# EAGLE schematic rev_i_v127 (EAGLE 9.7.0)
AUTHOR: Pat Pannuto; REV: I; TITLE: TotTag

## Sheet 1 of 5: nRF8240
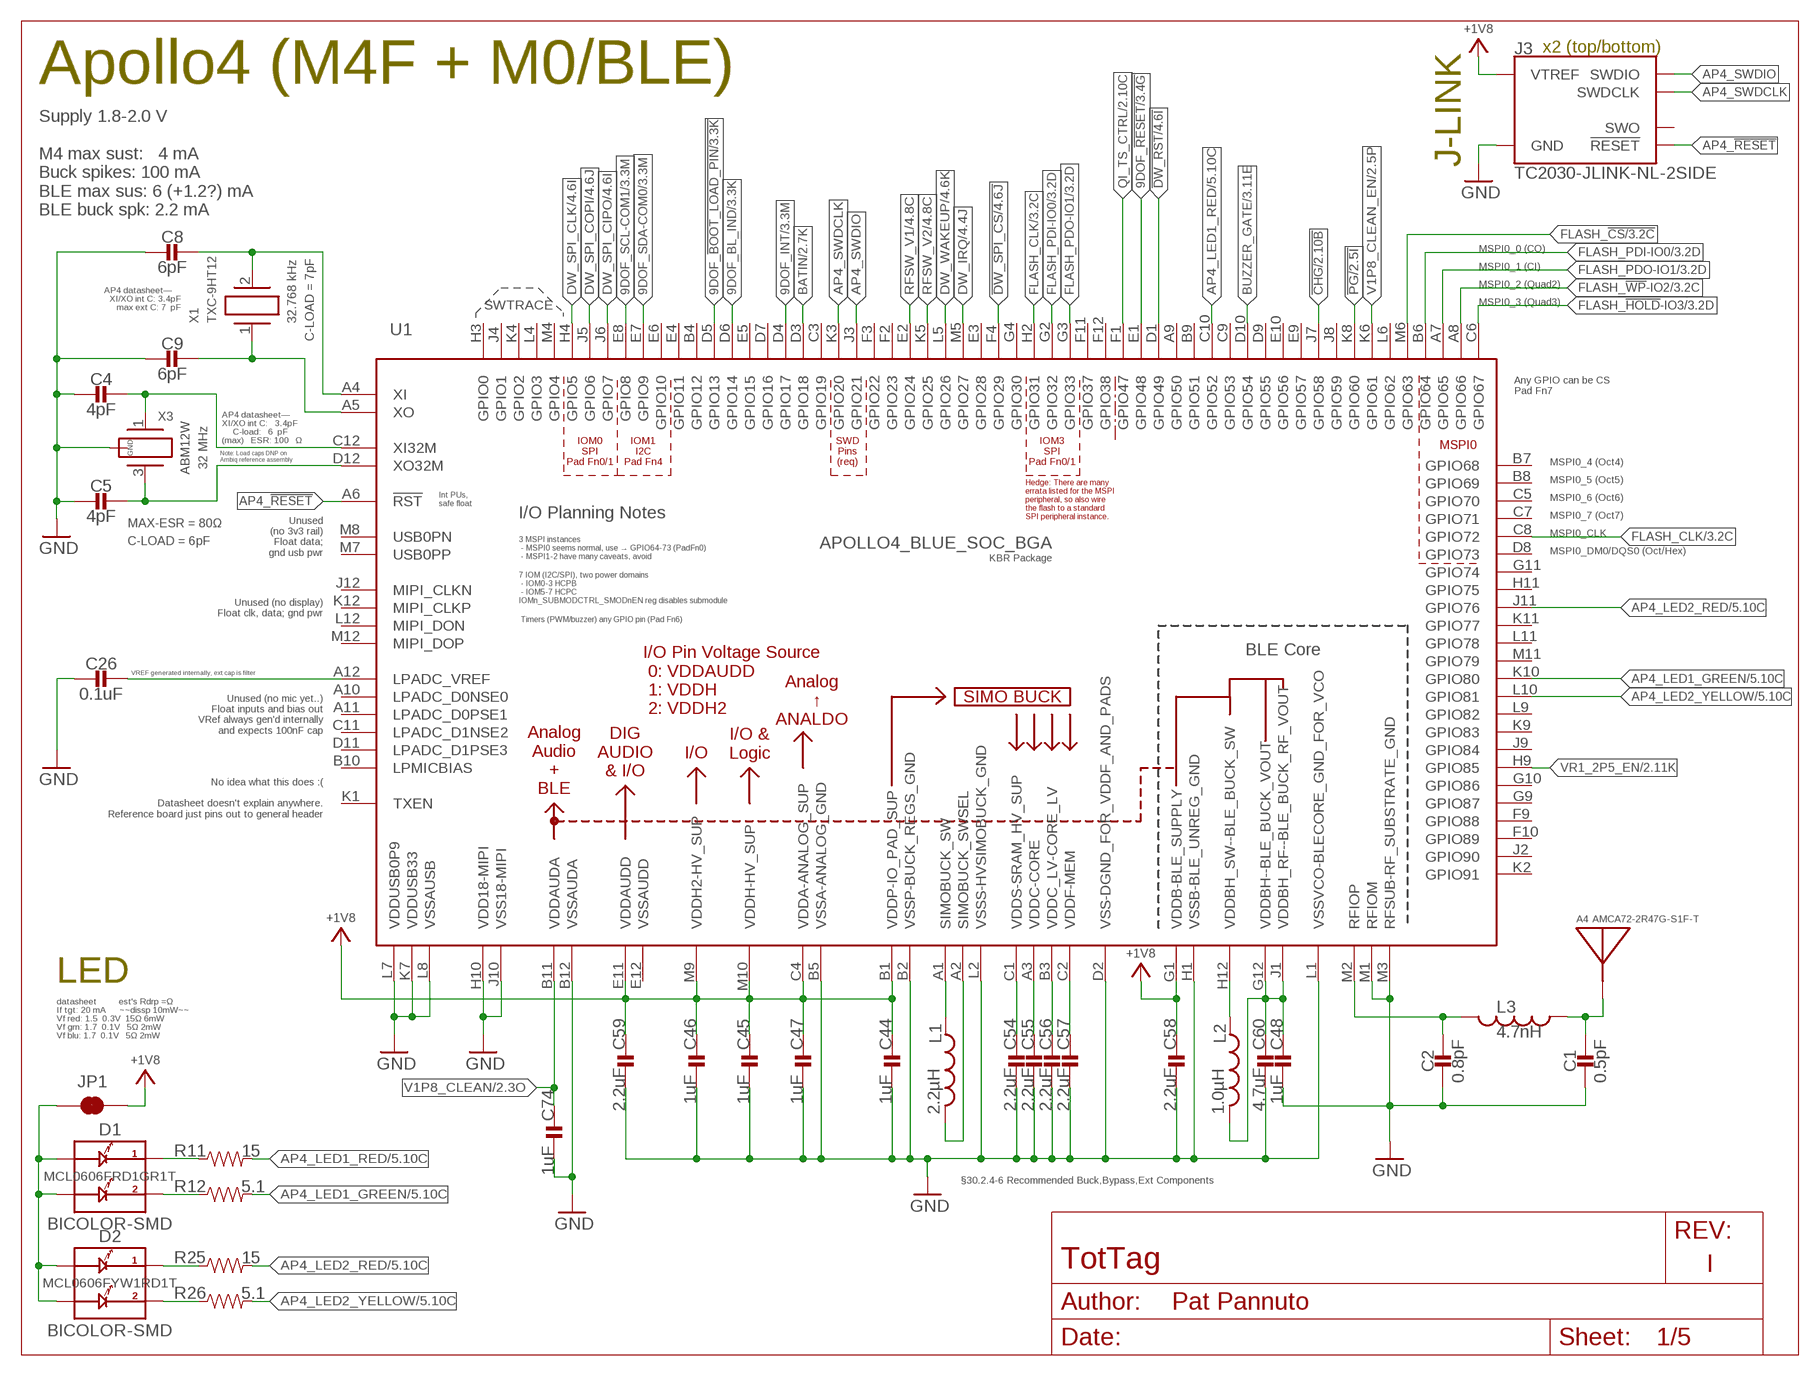
[diagram p0: schematic, sheet 1]

### Parts
A4  AMCA72-2R47G-S1F-T  [AMCA72-2R470G-S1F-T]
C1  0.5pF  CAPACITOR0402_CAP  [0402_CAP]
C2  0.8pF  CAPACITOR0402_CAP  [0402_CAP]
C4  4pF  CAPACITOR0201_CAP  [0201_CAP]
C5  4pF  CAPACITOR0201_CAP  [0201_CAP]
C8  6pF  CAPACITOR0201_CAP  [0201_CAP]
C9  6pF  CAPACITOR0201_CAP  [0201_CAP]
C26  0.1uF  CAPACITOR0201_CAP  [0201_CAP]
C44  1uF  CAPACITOR0201_CAP  [0201_CAP]
C45  1uF  CAPACITOR0201_CAP  [0201_CAP]
C46  1uF  CAPACITOR0201_CAP  [0201_CAP]
C47  1uF  CAPACITOR0201_CAP  [0201_CAP]
C48  1uF  CAPACITOR0201_CAP  [0201_CAP]
C54  2.2uF  CAPACITOR0201_CAP  [0201_CAP]
C55  2.2uF  CAPACITOR0201_CAP  [0201_CAP]
C56  2.2uF  CAPACITOR0201_CAP  [0201_CAP]
C57  2.2uF  CAPACITOR0201_CAP  [0201_CAP]
C58  2.2uF  CAPACITOR0201_CAP  [0201_CAP]
C59  2.2uF  CAPACITOR0201_CAP  [0201_CAP]
C60  4.7uF  CAPACITOR0402_CAP  [0402_CAP]
C74  1uF  CAPACITOR0201_CAP  [0201_CAP]
D1  BICOLOR-SMD  [LED-0606]
D2  BICOLOR-SMD  [LED-0606]
J3  TC2030-JLINK-NL-2SIDE  [TC2030-IDC-NL-2SIDE]
JP1  JUMPER-SMT_2_NC_TRACE_SILK  [SMT-JUMPER_2_NC_TRACE_SILK]
L1  2.2µH  INDUCTOR0805  [0805_CAP]
L2  1.0µH  INDUCTOR0603  [0603_CAP]
L3  4.7nH  INDUCTOR0402  [0402_CAP]
R11  15  RESISTOR0402_RES  [0402_RES]
R12  5.1  RESISTOR0402_RES  [0402_RES]
R25  15  RESISTOR0402_RES  [0402_RES]
R26  5.1  RESISTOR0402_RES  [0402_RES]
U1  APOLLO4_BLUE_SOC_BGA  [APOLLO4_BLUE_SOC_BGA]
X1  TXC-9HT12  [TXC-9HT12]
X3  ABM12W  [ABM12W]

### Nets
9DOF_!BOOT_LOAD_PIN: U1.D5(GPIO13) ; also sheet 3
9DOF_!RESET: U1.E1(GPIO48) ; also sheet 3
9DOF_BL_IND: U1.D6(GPIO14) ; also sheet 3
9DOF_INT: U1.D4(GPIO17) ; also sheet 3,5
9DOF_SCL-COM1: U1.E8(GPIO8) ; also sheet 3,5
9DOF_SDA-COM0: U1.E7(GPIO9) ; also sheet 3,5
!CHG: U1.J7(GPIO58) ; also sheet 2
!DW_RST: U1.D1(GPIO49) ; also sheet 4
!DW_SPI_CS: U1.F4(GPIO29) ; also sheet 4,5
!PG: U1.K8(GPIO60) ; also sheet 2
+1V8: C44.P$1 C45.P$1 C46.P$1 C47.P$1 C58.P$1 C59.P$1 J3.1(VTREF) J3.B1(VTREF) JP1.2 U1.B1(VDDP-IO_PAD_SUP) U1.C4(VDDA-ANALOG_SUP) U1.E11(VDDAUDD) U1.G1(VDDB-BLE_SUPPLY) U1.M9(VDDH2-HV_SUP) U1.M10(VDDH-HV_SUP) ; also sheet 2,3,4
AP4_!RESET: J3.3(!RESET) J3.B3(!RESET) U1.A6(!RST)
AP4_LED1_GREEN: R12.2 U1.K10(GPIO80) ; also sheet 5
AP4_LED1_RED: R11.2 U1.C10(GPIO52) ; also sheet 5
AP4_LED2_BLUE_COMM: D1.1-C1(C1) R11.1
AP4_LED2_RED: R25.2 U1.J11(GPIO76) ; also sheet 5
AP4_LED2_YELLOW: R26.2 U1.L10(GPIO81) ; also sheet 5
AP4_LED_BLUE_COMM: D2.2-C2(C2) R26.1
AP4_LED_GREEN_COMM: D2.1-C1(C1) R25.1
AP4_LED_RED_COMM: D1.2-C2(C2) R12.1
AP4_LPADC_VREF: C26.P$1 U1.A12(LPADC_VREF)
AP4_RFIOP: C2.1 L3.2 U1.M2(RFIOP)
AP4_SWDCLK: J3.4(SWDCLK) J3.B4(SWDCLK) U1.K3(GPIO20)
AP4_SWDIO: J3.2(SWDIO) J3.B2(SWDIO) U1.J3(GPIO21)
AP4_VDDBH: C48.P$1 C60.1 L2.2 U1.G12(VDDBH--BLE_BUCK_VOUT) U1.J1(VDDBH_RF--BLE_BUCK_RF_VOUT)
AP4_VDDBH_SW: L2.1 U1.H12(VDDBH_SW--BLE_BUCK_SW)
AP4_VDDC: C55.P$1 U1.A3(VDDC-CORE)
AP4_VDDC_LV: C56.P$1 U1.B3(VDDC_LV-CORE_LV)
AP4_VDDF: C57.P$1 U1.C2(VDDF-MEM)
AP4_VDDS: C54.P$1 U1.C1(VDDS-SRAM_HV_SUP)
AP4_XI: C8.P$1 U1.A4(XI) X1.2
AP4_XI32M: C4.P$1 U1.C12(XI32M) X3.1
AP4_XO: C9.P$1 U1.A5(XO) X1.1
AP4_XO32M: C5.P$1 U1.D12(XO32M) X3.3
BATIN: U1.D3(GPIO18) ; also sheet 2
BLE_ANT_FEED: A4.S1(ANTENNA) C1.1 L3.1
BUZZER_GATE: U1.D10(GPIO54) ; also sheet 3
DW_IRQ: U1.M5(GPIO27) ; also sheet 4
DW_SPI_CIPO: U1.J6(GPIO7) ; also sheet 4,5
DW_SPI_CLK: U1.H4(GPIO5) ; also sheet 4,5
DW_SPI_COPI: U1.J5(GPIO6) ; also sheet 4,5
DW_WAKEUP: U1.L5(GPIO26) ; also sheet 4
FLASH_!CS: U1.M6(GPIO63) ; also sheet 3,5
FLASH_!HOLD!-IO3: U1.C6(GPIO67) ; also sheet 3,5
FLASH_!WP!-IO2: U1.A8(GPIO66) ; also sheet 3,5
FLASH_CLK: U1.C8(GPIO72) U1.H2(GPIO31) ; also sheet 3,5
FLASH_PDI-IO0: U1.B6(GPIO64) U1.G2(GPIO32) ; also sheet 3,5
FLASH_PDO-IO1: U1.A7(GPIO65) U1.G3(GPIO33) ; also sheet 3,5
GND: C1.2 C2.2 C4.P$2 C5.P$2 C8.P$2 C9.P$2 C26.P$2 C44.P$2 C45.P$2 C46.P$2 C47.P$2 C48.P$2 C54.P$2 C55.P$2 C56.P$2 C57.P$2 C58.P$2 C59.P$2 C60.2 C74.P$2 J3.5(GND) J3.B5(GND) U1.B2(VSSP-BUCK_REGS_GND) U1.B5(VSSA-ANALOG_GND) U1.B12(VSSAUDA) U1.D2(VSS-DGND_FOR_VDDF_AND_PADS) U1.H1(VSSB-BLE_UNREG_GND) U1.H10(VDD18-MIPI) U1.J10(VSS18-MIPI) U1.K7(VDDUSB33) U1.L1(VSSVCO-BLECORE_GND_FOR_VCO) U1.L2(VSSS-HVSIMOBUCK_GND) U1.L7(VDDUSB0P9) U1.L8(VSSAUSB) U1.M1(RFIOM) U1.M3(RFSUB-RF_SUBSTRATE_GND) X3.2(GND) X3.4(GND) ; also sheet 2,3,4
LED_SUP: D1.3-A1(A1) D1.4-A2(A2) D2.3-A1(A1) D2.4-A2(A2) JP1.1
N$8: L1.P$1 U1.A1(SIMOBUCK_SW)
N$14: L1.P$2 U1.A2(SIMOBUCK_SWSEL)
QI_TS_CTRL: U1.F1(GPIO47) ; also sheet 2
RFSW_V1: U1.E2(GPIO24) ; also sheet 4
RFSW_V2: U1.K5(GPIO25) ; also sheet 4
V1P8_CLEAN: C74.P$1 U1.B11(VDDAUDA) ; also sheet 2
V1P8_CLEAN_EN: U1.K6(GPIO61) ; also sheet 2
VR1_2P5_EN: U1.H9(GPIO85) ; also sheet 2
Unconnected: J3.6(SWO) J3.B6(SWO) U1.A9(GPIO50) U1.A10(LPADC_D0NSE0) U1.A11(LPADC_D0PSE1) U1.B4(GPIO12) U1.B7(GPIO68) U1.B8(GPIO69) U1.B9(GPIO51) U1.B10(LPMICBIAS) U1.C3(GPIO19) U1.C5(GPIO70) U1.C7(GPIO71) U1.C9(GPIO53) U1.C11(LPADC_D1NSE2) U1.D7(GPIO16) U1.D8(GPIO73) U1.D9(GPIO55) U1.D11(LPADC_D1PSE3) U1.E3(GPIO28) U1.E4(GPIO11) U1.E5(GPIO15) U1.E6(GPIO10) U1.E9(GPIO57) U1.E10(GPIO56) U1.E12(VSSAUDD) U1.F2(GPIO23) U1.F3(GPIO22) U1.F9(GPIO88) U1.F10(GPIO89) U1.F11(GPIO37) U1.F12(GPIO38) U1.G4(GPIO30) U1.G9(GPIO87) U1.G10(GPIO86) U1.G11(GPIO74) U1.H3(GPIO0) U1.H11(GPIO75) U1.J2(GPIO90) U1.J4(GPIO1) U1.J8(GPIO59) U1.J9(GPIO84) U1.J12(MIPI_CLKN) U1.K1(TXEN) U1.K2(GPIO91) U1.K4(GPIO2) U1.K9(GPIO83) U1.K11(GPIO77) U1.K12(MIPI_CLKP) U1.L4(GPIO3) U1.L6(GPIO62) U1.L9(GPIO82) U1.L11(GPIO78) U1.L12(MIPI_DON) U1.M4(GPIO4) U1.M7(USB0PP) U1.M8(USB0PN) U1.M11(GPIO79) U1.M12(MIPI_DOP)

### Notes on the sheet
- Apollo4 (M4F + M0/BLE)
- x2 (top/bottom)
- Supply 1.8-2.0 V
  
  M4 max sust:   4 mA
  Buck spikes: 100 mA
  BLE max sus: 6 (+1.2?) mA
  BLE buck spk: 2.2 mA
- J-LINK
- MSPI0_0 (CO)
- MSPI0_1 (CI)
- AP4 datasheet—    
  XI/XO int C: 3.4pF
    max ext C: 7  pF
- MSPI0_2 (Quad2)
- SWTRACE | MSPI0_3 (Quad3)
- Any GPIO can be CS
  Pad Fn7
- AP4 datasheet—    
  XI/XO int C:   3.4pF
       C-load:   6  pF
  (max)   ESR: 100   Ω
- MSPI0
- Note: Load caps DNP on
  Ambiq reference assembly
- IOM0
  SPI
  Pad Fn0/1
- IOM1
  I2C
  Pad Fn4
- SWD
  Pins
  (req)
- IOM3
  SPI
  Pad Fn0/1
- MSPI0_4 (Oct4)
- Hedge: There are many
  errata listed for the MSPI
  peripheral, so also wire
  the flash to a standard
  SPI peripheral instance.
- MSPI0_5 (Oct5)
- Int PUs,
  safe float
- MSPI0_6 (Oct6)
- I/O Planning Notes | MSPI0_7 (Oct7)
- Unused
  (no 3v3 rail)
  Float data;
  gnd usb pwr
- 3 MSPI instances
   - MSPI0 seems normal, use → GPIO64-73 (PadFn0)
   - MSPI1-2 have many caveats, avoid
- MSPI0_CLK
- KBR Package | MSPI0_DM0/DQS0 (Oct/Hex)
- 7 IOM (I2C/SPI), two power domains
   - IOM0-3 HCPB
   - IOM5-7 HCPC
  IOMn_SUBMODCTRL_SMODnEN reg disables submodule
- Unused (no display)
  Float clk, data; gnd pwr
- Timers (PWM/buzzer) any GPIO pin (Pad Fn6)
- VREF generated internally, ext cap is filter
- Unused (no mic yet..)
  Float inputs and bias out
  VRef always gen'd internally
  and expects 100nF cap
- No idea what this does :(
  
  Datasheet doesn't explain anywhere.
  Reference board just pins out to general header
- LED
- datasheet          est's Rdrp =Ω
  If tgt: 20 mA      ~~dissp 10mW~~
  Vf red: 1.5  0.3V  15Ω 6mW
  Vf grn: 1.7  0.1V   5Ω 2mW
  Vf blu: 1.7  0.1V   5Ω 2mW
- §30.2.4-6 Recommended Buck,Bypass,Ext Components

## Sheet 2 of 5: Power
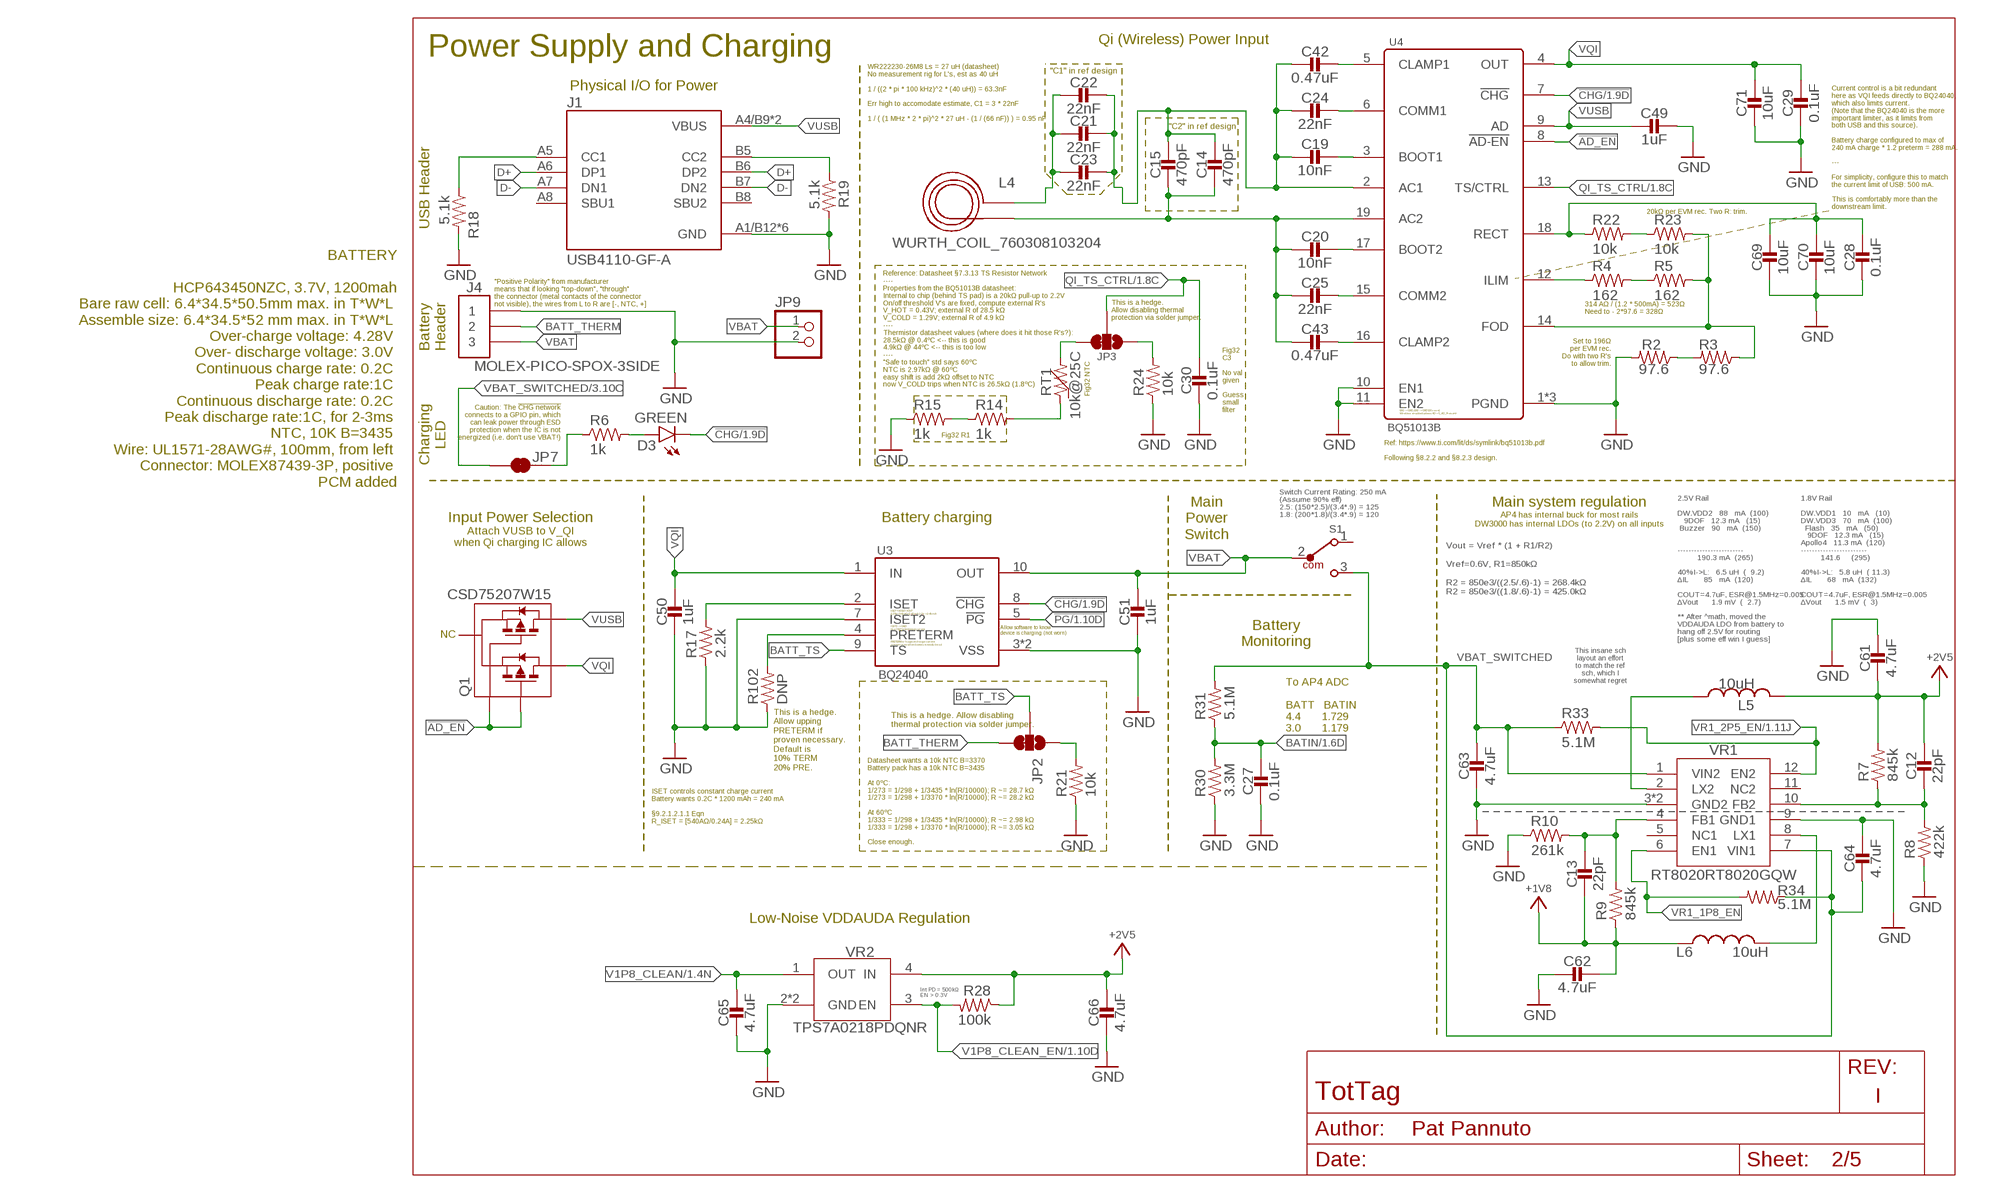
[diagram p1: schematic, sheet 2]

### Parts
C12  22pF  CAPACITOR0201_CAP  [0201_CAP]
C13  22pF  CAPACITOR0201_CAP  [0201_CAP]
C14  470pF  CAPACITOR0402_CAP  [0402_CAP]
C15  470pF  CAPACITOR0402_CAP  [0402_CAP]
C19  10nF  CAPACITOR0402_CAP  [0402_CAP]
C20  10nF  CAPACITOR0402_CAP  [0402_CAP]
C21  22nF  CAPACITOR0402_CAP  [0402_CAP]
C22  22nF  CAPACITOR0402_CAP  [0402_CAP]
C23  22nF  CAPACITOR0402_CAP  [0402_CAP]
C24  22nF  CAPACITOR0402_CAP  [0402_CAP]
C25  22nF  CAPACITOR0402_CAP  [0402_CAP]
C27  0.1uF  CAPACITOR0402_CAP  [0402_CAP]
C28  0.1uF  CAPACITOR0402_CAP  [0402_CAP]
C29  0.1uF  CAPACITOR0402_CAP  [0402_CAP]
C30  0.1uF  CAPACITOR0402_CAP  [0402_CAP]
C42  0.47uF  CAPACITOR0402_CAP  [0402_CAP]
C43  0.47uF  CAPACITOR0402_CAP  [0402_CAP]
C49  1uF  CAPACITOR0402_CAP  [0402_CAP]
C50  1uF  CAPACITOR0402_CAP  [0402_CAP]
C51  1uF  CAPACITOR0402_CAP  [0402_CAP]
C61  4.7uF  CAPACITOR0805_CAP  [0805_CAP]
C62  4.7uF  CAPACITOR0805_CAP  [0805_CAP]
C63  4.7uF  CAPACITOR0805_CAP  [0805_CAP]
C64  4.7uF  CAPACITOR0805_CAP  [0805_CAP]
C65  4.7uF  CAPACITOR0805_CAP  [0805_CAP]
C66  4.7uF  CAPACITOR0805_CAP  [0805_CAP]
C69  10uF  CAPACITOR0603_CAP  [0603_CAP]
C70  10uF  CAPACITOR0603_CAP  [0603_CAP]
C71  10uF  CAPACITOR0603_CAP  [0603_CAP]
D3  GREEN  LED0603  [LED-0603]
J1  USB4110-GF-A  [GCT_USB4110-GF-A]
J4  MOLEX-PICO-SPOX-3SIDE  [MOLEX-PICO-SPOX-3_SIDE]
JP2  JUMPER-SMT_3_1-NC_TRACE_SILK  [SMT-JUMPER_3_1-NC_TRACE_SILK]
JP3  JUMPER-SMT_3_1-NC_TRACE_SILK  [SMT-JUMPER_3_1-NC_TRACE_SILK]
JP7  JUMPER-SMT_2_NC_TRACE_SILK  [SMT-JUMPER_2_NC_TRACE_SILK]
JP9  PINHD-1X2  [1X02]
L4  WURTH_COIL_760308103204  [WURTH_COIL_760308103204]
L5  10uH  INDUCTORNRX3015  [NRX3015]
L6  10uH  INDUCTORNRX3015  [NRX3015]
Q1  CSD75207W15  [DSBGA]
R2  97.6  RESISTOR0402_RES  [0402_RES]
R3  97.6  RESISTOR0402_RES  [0402_RES]
R4  162  RESISTOR0402_RES  [0402_RES]
R5  162  RESISTOR0402_RES  [0402_RES]
R6  1k  RESISTOR0402_RES  [0402_RES]
R7  845k  RESISTOR0201_RES  [0201_RES]
R8  422k  RESISTOR0201_RES  [0201_RES]
R9  845k  RESISTOR0201_RES  [0201_RES]
R10  261k  RESISTOR0201_RES  [0201_RES]
R14  1k  RESISTOR0402_RES  [0402_RES]
R15  1k  RESISTOR0402_RES  [0402_RES]
R17  2.2k  RESISTOR0402_RES  [0402_RES]
R18  5.1k  RESISTOR0402_RES  [0402_RES]
R19  5.1k  RESISTOR0402_RES  [0402_RES]
R21  10k  RESISTOR0402_RES  [0402_RES]
R22  10k  RESISTOR0402_RES  [0402_RES]
R23  10k  RESISTOR0402_RES  [0402_RES]
R24  10k  RESISTOR0402_RES  [0402_RES]
R28  100k  RESISTOR0402_RES  [0402_RES]
R30  3.3M  RESISTOR0402_RES  [0402_RES]
R31  5.1M  RESISTOR0402_RES  [0402_RES]
R33  5.1M  RESISTOR0402_RES  [0402_RES]
R34  5.1M  RESISTOR0402_RES  [0402_RES]
R102  DNP  RESISTOR0402_RES  [0402_RES]
RT1  10k@25C  THERMISTOR0402  [0402_RES]
S1  450404015514  [450404015514]
U3  BQ24040  [DSQ0010A]
U4  BQ51013B  [RHL0020A]
VR1  RT8020RT8020GQW  [SON45P300X300X80-13T160X250N]
VR2  TPS7A0218PDQNR  [4-XDFN-EP]

### Nets
!AD_EN: Q1.A1(G1) Q1.C1(G2) U4.8(!AD-EN)
!CHG: D3.C U3.8(!CHG) U4.7(!CHG) ; also sheet 1
!PG: U3.5(!PG) ; also sheet 1
+1V8: C13.P$2 C62.P$1 L6.P$1 R9.1 ; also sheet 1,3,4
+2V5: C12.P$1 C61.P$2 C66.P$1 L5.P$2 R7.2 R28.1 VR2.4(IN) ; also sheet 3,4
BATIN: C27.1 R30.2 R31.1 ; also sheet 1
BATT_THERM: J4.2 J4.2SUPP JP2.3
BATT_TS: JP2.2 U3.9(TS)
BQ_AC1: C14.1 C15.1 C19.2 C21.1 C22.1 C23.1 C24.2 C42.2 U4.2(AC1)
BQ_AC2: C14.2 C15.2 C20.2 C25.2 C43.2 L4.P$2 U4.19(AC2)
BQ_BOOT1: C19.1 U4.3(BOOT1)
BQ_BOOT2: C20.1 U4.17(BOOT2)
BQ_CLAMP1: C42.1 U4.5(CLAMP1)
BQ_CLAMP2: C43.1 U4.16(CLAMP2)
BQ_COMM1: C24.1 U4.6(COMM1)
BQ_COMM2: C25.1 U4.15(COMM2)
BQ_FOD: R3.1 R5.2 R23.2 U4.14(FOD)
BQ_ILM: R4.1 U4.12(ILIM)
BQ_ISET: R17.2 U3.2(ISET)
BQ_RECT: C28.1 C69.1 C70.1 R22.1 U4.18(RECT)
COIL_AC1: C21.2 C22.2 C23.2 L4.P$1
D+: J1.A6(DP1) J1.B6(DP2)
D-: J1.A7(DN1) J1.B7(DN2)
GND: C27.2 C28.2 C29.2 C30.2 C49.1 C50.2 C51.2 C61.P$1 C62.P$2 C63.P$2 C64.P$1 C65.P$2 C66.P$2 C69.2 C70.2 C71.2 J1.A1/B12(GND) J1.B1/A12(GND) J1.S1(GND) J1.S2(GND) J1.S3(GND) J1.S4(GND) J4.1 J4.1SUPP JP9.2 R2.2 R8.1 R10.1 R15.1 R17.1 R18.2 R19.2 R21.1 R24.1 R30.1 R102.1 U3.3(VSS) U3.7(ISET2) U3.PAD(VSS) U4.1(PGND) U4.10(EN1) U4.11(EN2) U4.20(PGND) U4.PAD(PGND) VR1.3(GND2) VR1.9(GND1) VR1.13(GND2) VR2.2(GND) VR2.PAD(GND) ; also sheet 1,3,4
N$1: J1.B5(CC2) R19.1
N$13: J1.A5(CC1) R18.1
N$28: R2.1 R3.2
N$47: JP2.1 R21.2
N$49: R102.2 U3.4(PRETERM)
N$54: D3.A R6.2
N$64: R22.2 R23.1
N$66: R4.2 R5.1
N$67: JP3.1 R24.2
N$68: JP3.3 RT1.2
N$69: R14.2 RT1.1
N$70: R14.1 R15.2
QI_TS_CTRL: C30.1 JP3.2 U4.13(TS/CTRL) ; also sheet 1
V1P8_CLEAN: C65.P$1 VR2.1(OUT) ; also sheet 1
V1P8_CLEAN_EN: R28.2 VR2.3(EN) ; also sheet 1
VBAT: C51.1 J4.3 J4.3SUPP JP9.1 S1.2 U3.10(OUT)
VBAT_SW_FOR_CHGLED: JP7.2 R6.1
VBAT_SWITCHED: C63.P$1 C64.P$2 JP7.1 R31.2 R33.1 R34.1 S1.3 VR1.1(VIN2) VR1.7(VIN1) ; also sheet 3
VQI: C29.1 C50.1 C71.1 Q1.A2(D1) Q1.A3(D1) Q1.B3(D1) U3.1(IN) U4.4(OUT)
VR1_1P8_EN: R34.2 VR1.6(EN1)
VR1_2P5_EN: R33.2 VR1.12(EN2) ; also sheet 1
VR1_FB1: C13.P$1 R9.2 R10.2 VR1.4(FB1)
VR1_FB2: C12.P$2 R7.1 R8.2 VR1.10(FB2)
VR1_LX1: L6.P$2 VR1.8(LX1)
VR1_LX2: L5.P$1 VR1.2(LX2)
VUSB: C49.2 J1.A4/B9(VBUS) J1.B4/A9(VBUS) Q1.B2(D2) Q1.C2(D2) Q1.C3(D2) U4.9(AD)
Unconnected: J1.A8(SBU1) J1.B8(SBU2) Q1.B1(S) S1.1 VR1.5(NC1) VR1.11(NC2)

### Notes on the sheet
- Power Supply and Charging | Qi (Wireless) Power Input
- WR222230-26M8 Ls = 27 uH (datasheet)
  No measurement rig for L's, est as 40 uH
  
  1 / ((2 * pi * 100 kHz)^2 * (40 uH)) = 63.3nF
  
  Err high to accomodate estimate, C1 = 3 * 22nF
  
  1 / ( (1 MHz * 2 * pi)^2 * 27 uH - (1 / (66 nF)) ) = 0.95 nF
- "C1" in ref design
- Physical I/O for Power
- "C2" in ref design
- USB Header
- 20kΩ per EVM rec. Two R: trim.
- Current control is a bit redundant
  here as VQI feeds directly to BQ24040,
  which also limits current.
  (Note that the BQ24040 is the more
  important limiter, as it limits from
  both USB and this source).
  
  Battery charge configured to max of
  240 mA charge * 1.2 preterm = 288 mA.
  
  ---
  
  For simplicity, configure this to match
  the current limit of USB: 500 mA.
  
  This is comfortably more than the
  downstream limit.
- BATTERY
  
  HCP643450NZC, 3.7V, 1200mah
  Bare raw cell: 6.4*34.5*50.5mm max. in T*W*L 
  Assemble size: 6.4*34.5*52 mm max. in T*W*L 
  Over-charge voltage: 4.28V 
  Over- discharge voltage: 3.0V 
  Continuous charge rate: 0.2C 
  Peak charge rate:1C 
  Continuous discharge rate: 0.2C 
  Peak discharge rate:1C, for 2-3ms 
  NTC, 10K B=3435 
  Wire: UL1571-28AWG#, 100mm, from left 
  Connector: MOLEX87439-3P, positive 
  PCM added
- Reference: Datasheet §7.3.13 TS Resistor Network
  ----
  Properties from the BQ51013B datasheet:
  Internal to chip (behind TS pad) is a 20kΩ pull-up to 2.2V
  On/off threshold V's are fixed, compute external R's
  V_HOT = 0.43V; external R of 28.5 kΩ
  V_COLD = 1.29V; external R of 4.9 kΩ
  ----
  Thermistor datasheet values (where does it hit those R's?):
  28.5kΩ @ 0.4ºC <-- this is good
  4.9kΩ @ 44ºC <-- this is too low
  ----
  "Safe to touch" std says 60ºC
  NTC is 2.97kΩ @ 60ºC
  easy shift is add 2kΩ offset to NTC
  now V_COLD trips when NTC is 26.5kΩ (1.8ºC)
- This is a hedge.
  Allow disabling thermal
  protection via solder jumper.
- 314 AΩ / (1.2 * 500mA) = 523Ω
  Need to - 2*97.6 = 328Ω
- "Positive Polarity" from manufacturer
  means that if looking "top-down", "through"
  the connector (metal contacts of the connector
  not visible), the wires from L to R are [-, NTC, +]
- Battery
  Header
- Set to 196Ω
  per EVM rec.
  Do with two R's
  to allow trim.
- Fig32
  C3
  
  No val
  given
  
  Guess
  small
  filter
- Fig32 NTC
- Caution: The !CHG network
  connects to a GPIO pin, which
  can leak power through ESD
  protection when the IC is not
  energized (i.e. don't use VBAT!)
- EN1 -> GND, EN2 -> GND [00 case]
  Wireless enabled unless AD > V_AD_Present
- Fig32 R1
- Charging
  LED
- Ref: https://www.ti.com/lit/ds/symlink/bq51013b.pdf
  
  Following §8.2.2 and §8.2.3 design.
- Switch Current Rating: 250 mA
  (Assume 90% eff)
  2.5: (150*2.5)/(3.4*.9) = 125
  1.8: (200*1.8)/(3.4*.9) = 120
- Main
  Power
  Switch
- Main system regulation
- 2.5V Rail
  
  DW.VDD2   88   mA  (100)
     9DOF   12.3 mA   (15)
   Buzzer   90   mA  (150)
  
  
  ------------------------
           190.3 mA  (265)
  
  40%I->L:   6.5 uH  (  9.2)
  ∆IL       85   mA  (120)
  
  COUT=4.7uF, ESR@1.5MHz=0.005
  ∆Vout      1.9 mV  (  2.7)
  
  ** After ^math, moved the
  VDDAUDA LDO from battery to
  hang off 2.5V for routing
  [plus some eff win I guess]
- 1.8V Rail
  
  DW.VDD1   10   mA   (10)
  DW.VDD3   70   mA  (100)
    Flash   35   mA   (50)
     9DOF   12.3 mA   (15)
  Apollo4   11.3 mA  (120)
  ------------------------
           141.6     (295)
  
  40%I->L:   5.8 uH  ( 11.3)
  ∆IL       68   mA  (132)
  
  COUT=4.7uF, ESR@1.5MHz=0.005
  ∆Vout      1.5 mV  (  3)
- Input Power Selection | Battery charging
- AP4 has internal buck for most rails
  DW3000 has internal LDOs (to 2.2V) on all inputs
- Attach VUSB to V_QI
  when Qi charging IC allows
- Vout = Vref * (1 + R1/R2)
  
  Vref=0.6V, R1=850kΩ
  
  R2 = 850e3/((2.5/.6)-1) = 268.4kΩ
  R2 = 850e3/((1.8/.6)-1) = 425.0kΩ
- ISET = KISET / IOUT
  2.25k = 540 AΩ / 240 mA; 2.2k -> 245 mA
- Battery
  Monitoring
- ISET2 -> GND
  Use ISET to limit input current
- Allow software to know
  device is charging (not worn)
- NC
- PRETERM is %age of charge current
  system uses when battery is totally dead
- This insane sch
  layout an effort
  to match the ref
  sch, which I
  somewhat regret
- This is a hedge.
  Allow upping
  PRETERM if
  proven necessary.
  Default is
  10% TERM
  20% PRE.
- This is a hedge. Allow disabling
  thermal protection via solder jumper.
- To AP4 ADC
  
  BATT   BATIN
  4.4       1.729
  3.0       1.179
- Datasheet wants a 10k NTC B=3370
  Battery pack has a 10k NTC B=3435
  
  At 0ºC:
  1/273 = 1/298 + 1/3435 * ln(R/10000); R ~= 28.7 kΩ
  1/273 = 1/298 + 1/3370 * ln(R/10000); R ~= 28.2 kΩ
  
  At 60ºC
  1/333 = 1/298 + 1/3435 * ln(R/10000); R ~= 2.98 kΩ
  1/333 = 1/298 + 1/3370 * ln(R/10000); R ~= 3.05 kΩ
  
  Close enough.
- ISET controls constant charge current
  Battery wants 0.2C * 1200 mAh = 240 mA
  
  §9.2.1.2.1.1 Eqn
  R_ISET = [540AΩ/0.24A] = 2.25kΩ
- Low-Noise VDDAUDA Regulation
- Int PD = 500kΩ
  EN > 0.3V

## Sheet 3 of 5: SD Card + Sensors
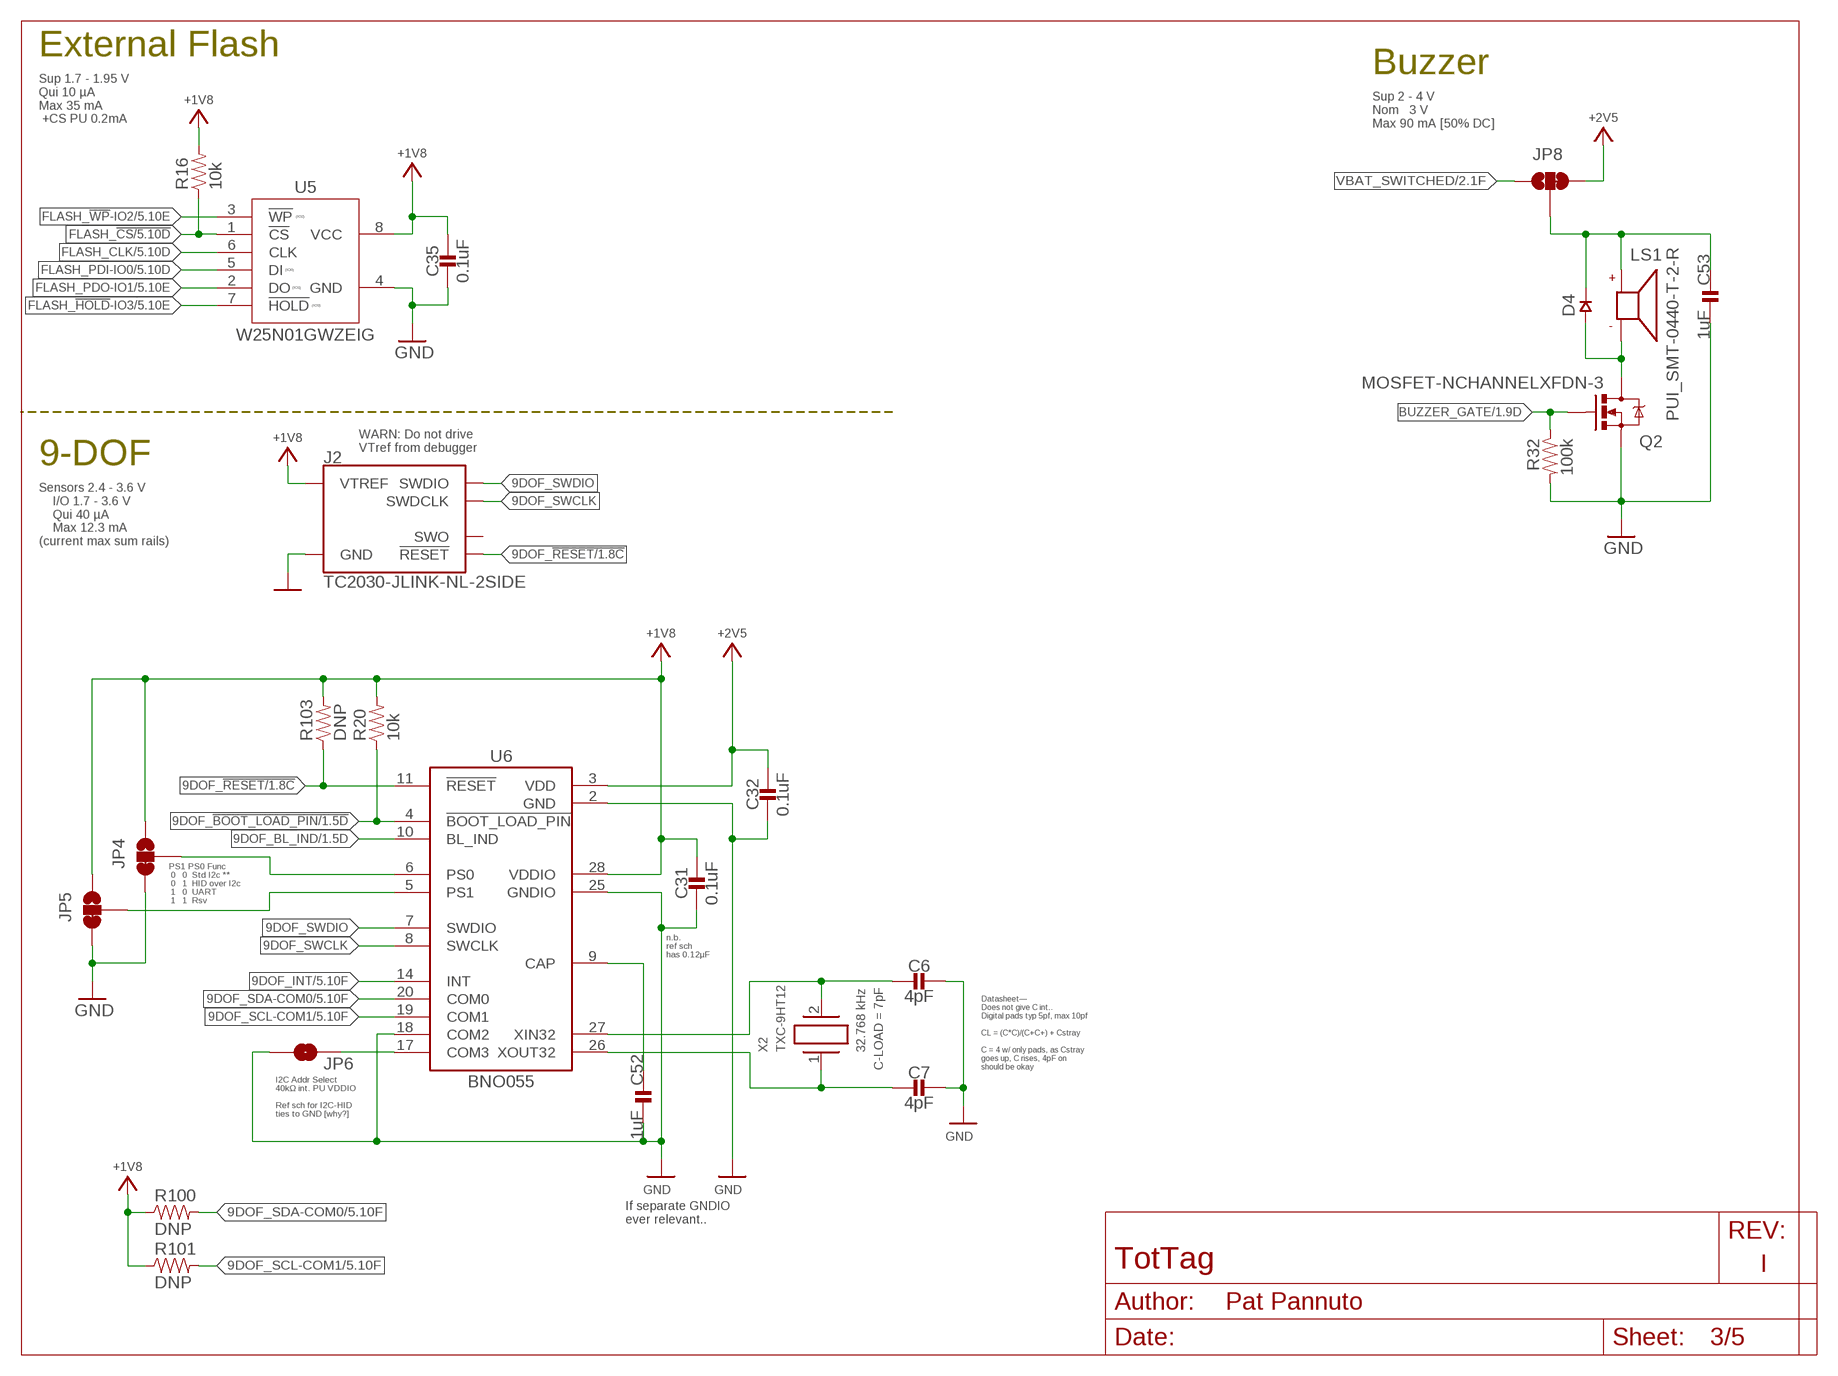
[diagram p2: schematic, sheet 3]

### Parts
C6  4pF  CAPACITOR0201_CAP  [0201_CAP]
C7  4pF  CAPACITOR0201_CAP  [0201_CAP]
C31  0.1uF  CAPACITOR0402_CAP  [0402_CAP]
C32  0.1uF  CAPACITOR0402_CAP  [0402_CAP]
C35  0.1uF  CAPACITOR0402_CAP  [0402_CAP]
C52  1uF  CAPACITOR0201_CAP  [0201_CAP]
C53  1uF  CAPACITOR0201_CAP  [0201_CAP]
D4  DIODE0402  [0402_DIODE]
J2  TC2030-JLINK-NL-2SIDE  [TC2030-IDC-NL-2SIDE]
JP4  JUMPER-SMT_3_1-NC_TRACE_SILK  [SMT-JUMPER_3_1-NC_TRACE_SILK]
JP5  JUMPER-SMT_3_1-NC_TRACE_SILK  [SMT-JUMPER_3_1-NC_TRACE_SILK]
JP6  JUMPER-SMT_2_NO_SILK  [SMT-JUMPER_2_NO_SILK]
JP8  JUMPER-SMT_3_1-NC_TRACE_SILK  [SMT-JUMPER_3_1-NC_TRACE_SILK]
LS1  PUI_SMT-0440-T-2-R  [SMT-0440-T-2-R]
Q2  MOSFET-NCHANNELXFDN-3  [XFDFN-3]
R16  10k  RESISTOR0402_RES  [0402_RES]
R20  10k  RESISTOR0402_RES  [0402_RES]
R32  100k  RESISTOR0402_RES  [0402_RES]
R100  DNP  RESISTOR0603_RES  [0603-RES]
R101  DNP  RESISTOR0603_RES  [0603-RES]
R103  DNP  RESISTOR0603_RES  [0603-RES]
U5  W25N01GWZEIG  [WSON127P800X600X80-9T430X340N]
U6  BNO055  [LGA28R0P510X4_5P2X3P8X1]
X2  TXC-9HT12  [TXC-9HT12]

### Nets
9DOF_!BOOT_LOAD_PIN: R20.1 U6.4(!BOOT_LOAD_PIN) ; also sheet 1
9DOF_!RESET: J2.3(!RESET) J2.B3(!RESET) R103.1 U6.11(!RESET) ; also sheet 1
9DOF_BL_IND: U6.10(BL_IND) ; also sheet 1
9DOF_CAP: C52.P$1 U6.9(CAP)
9DOF_INT: U6.14(INT) ; also sheet 1,5
9DOF_SCL-COM1: R101.2 U6.19(COM1) ; also sheet 1,5
9DOF_SDA-COM0: R100.2 U6.20(COM0) ; also sheet 1,5
9DOF_SWCLK: J2.4(SWDCLK) J2.B4(SWDCLK) U6.8(SWCLK)
9DOF_SWDIO: J2.2(SWDIO) J2.B2(SWDIO) U6.7(SWDIO)
9DOF_XI: C6.P$2 U6.27(XIN32) X2.2
9DOF_XO: C7.P$2 U6.26(XOUT32) X2.1
+1V8: C31.1 C35.1 J2.1(VTREF) J2.B1(VTREF) JP4.1 JP5.1 R16.2 R20.2 R100.1 R101.1 R103.2 U5.8(VCC) U6.28(VDDIO) ; also sheet 1,2,4
+2V5: C32.1 JP8.3 U6.3(VDD) ; also sheet 2,4
BUZZER_GATE: Q2.G R32.1 ; also sheet 1
BUZZER_SUPPLY: C53.P$1 D4.CATHODE JP8.2 LS1.+(P)
FLASH_!CS: R16.1 U5.1(!CS) ; also sheet 1,5
FLASH_!HOLD!-IO3: U5.7(!HOLD) ; also sheet 1,5
FLASH_!WP!-IO2: U5.3(!WP) ; also sheet 1,5
FLASH_CLK: U5.6(CLK) ; also sheet 1,5
FLASH_PDI-IO0: U5.5(DI) ; also sheet 1,5
FLASH_PDO-IO1: U5.2(DO) ; also sheet 1,5
GND: C6.P$1 C7.P$1 C31.2 C32.2 C35.2 C52.P$2 C53.P$2 J2.5(GND) J2.B5(GND) JP4.3 JP5.3 JP6.1 Q2.S R32.2 U5.4(GND) U6.2(GND) U6.18(COM2) U6.25(GNDIO) ; also sheet 1,2,4
N$2: D4.ANODE LS1.-(N) Q2.D
N$25: JP4.2 U6.6(PS0)
N$33: JP5.2 U6.5(PS1)
N$42: JP6.2 U6.17(COM3)
VBAT_SWITCHED: JP8.1 ; also sheet 2
Unconnected: J2.6(SWO) J2.B6(SWO)

### Notes on the sheet
- External Flash
- Sup 1.7 - 1.95 V
  Qui 10 µA
  Max 35 mA
   +CS PU 0.2mA
- Buzzer
- Sup 2 - 4 V
  Nom   3 V
  Max 90 mA [50% DC]
- WARN: Do not drive
  VTref from debugger
- 9-DOF
- Sensors 2.4 - 3.6 V
      I/O 1.7 - 3.6 V
      Qui 40 µA
      Max 12.3 mA
  (current max sum rails)
- PS1 PS0 Func
   0   0  Std I2c **
   0   1  HID over I2c
   1   0  UART
   1   1  Rsv
- n.b.
  ref sch
  has 0.12µF
- Datasheet—
  Does not give C int..
  Digital pads typ 5pf, max 10pf
  
  CL = (C*C)/(C+C+) + Cstray
  
  C = 4 w/ only pads, as Cstray
  goes up, C rises, 4pF on
  should be okay
- I2C Addr Select
  40kΩ int. PU VDDIO
  
  Ref sch for I2C-HID
  ties to GND [why?]
- If separate GNDIO
  ever relevant..

## Sheet 4 of 5: Localization module
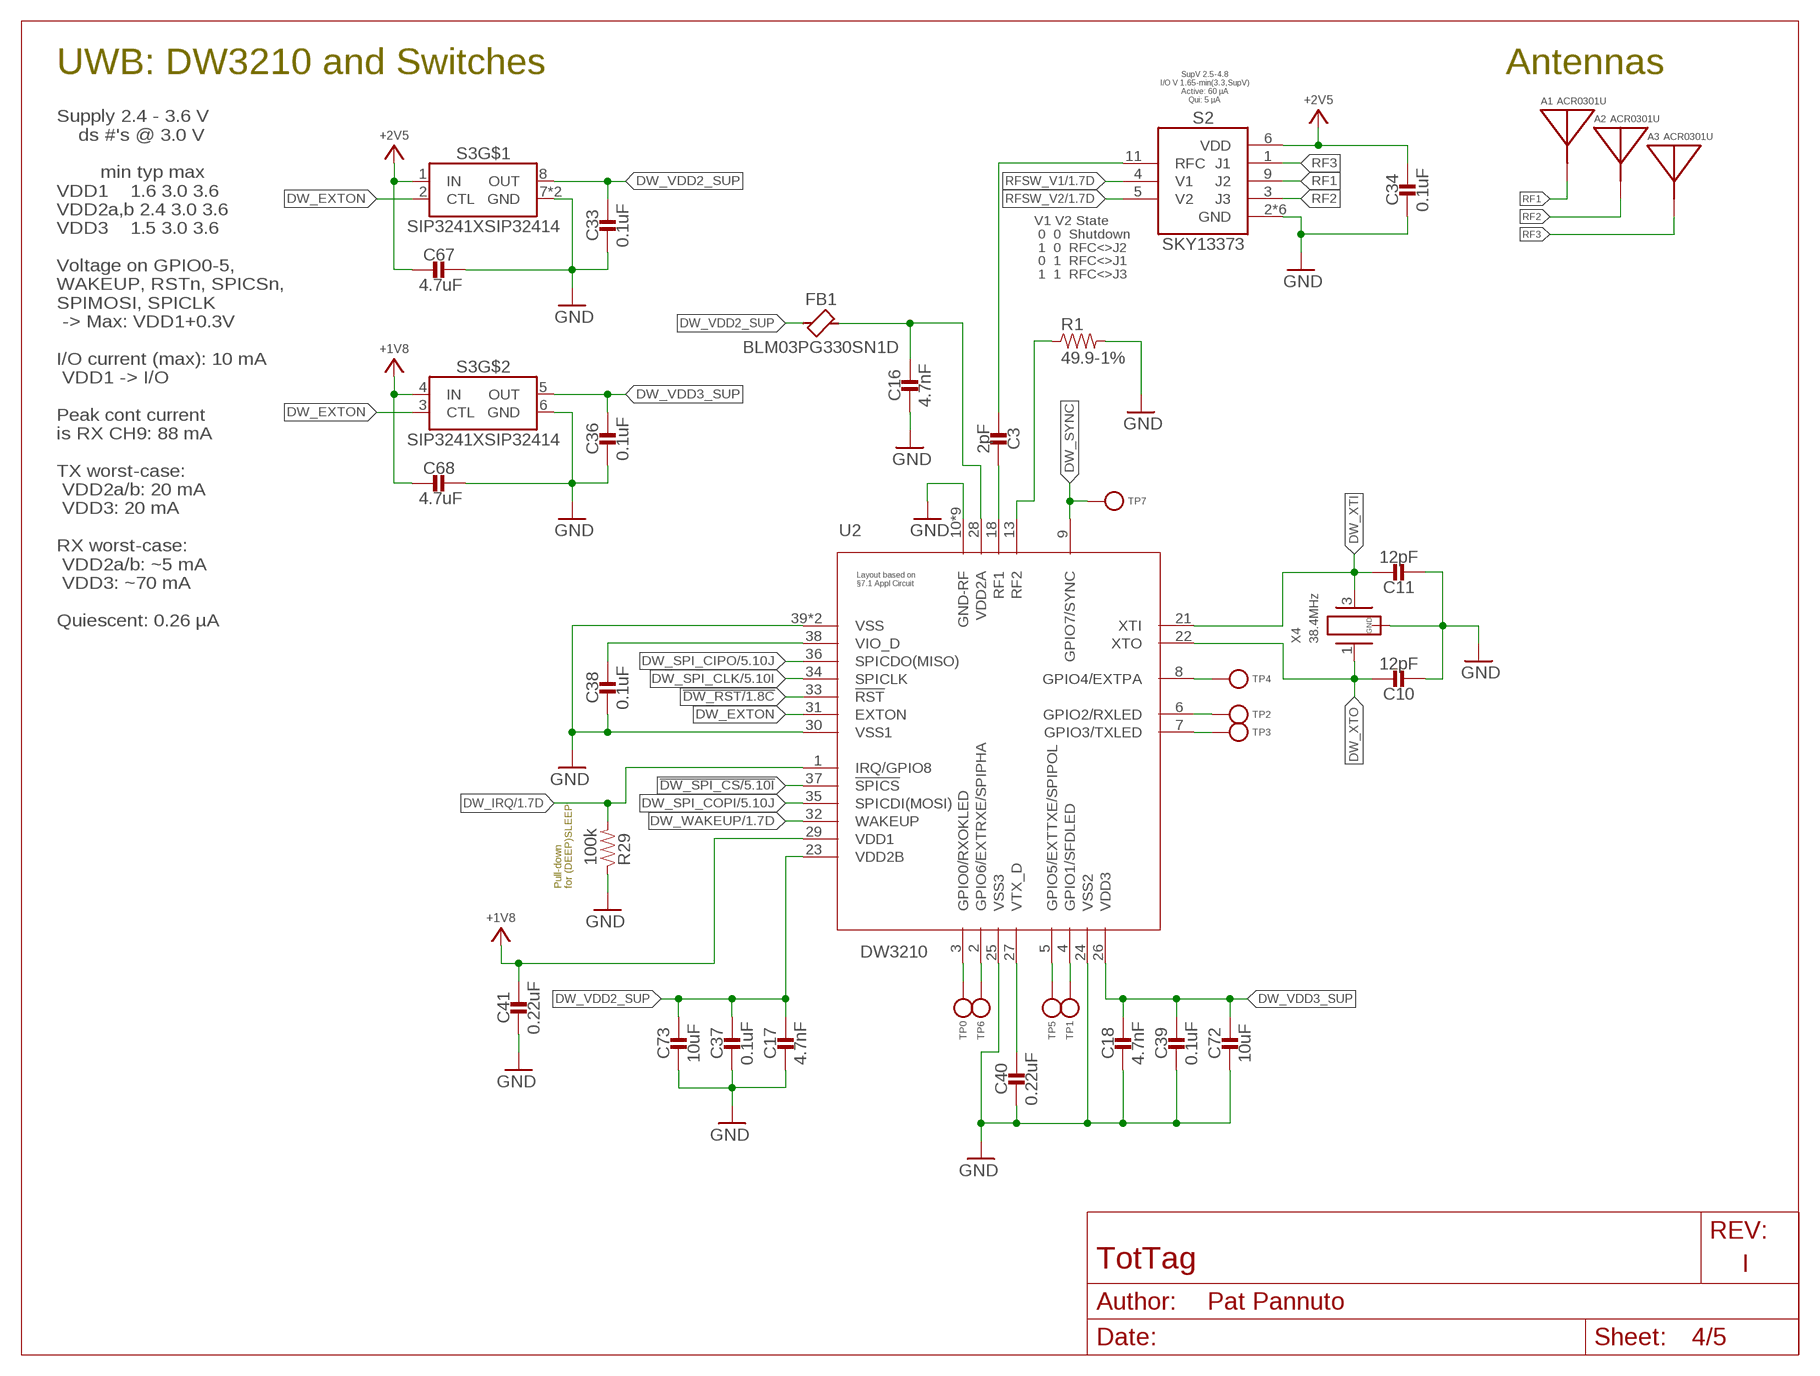
[diagram p3: schematic, sheet 4]

### Parts
A1  ACR0301U  [ACR0301U]
A2  ACR0301U  [ACR0301U]
A3  ACR0301U  [ACR0301U]
C3  2pF  CAPACITOR0201_CAP  [0201_CAP]
C10  12pF  CAPACITOR0402_CAP  [0402_CAP]
C11  12pF  CAPACITOR0402_CAP  [0402_CAP]
C16  4.7nF  CAPACITOR0402_CAP  [0402_CAP]
C17  4.7nF  CAPACITOR0402_CAP  [0402_CAP]
C18  4.7nF  CAPACITOR0402_CAP  [0402_CAP]
C33  0.1uF  CAPACITOR0402_CAP  [0402_CAP]
C34  0.1uF  CAPACITOR0402_CAP  [0402_CAP]
C36  0.1uF  CAPACITOR0402_CAP  [0402_CAP]
C37  0.1uF  CAPACITOR0402_CAP  [0402_CAP]
C38  0.1uF  CAPACITOR0402_CAP  [0402_CAP]
C39  0.1uF  CAPACITOR0402_CAP  [0402_CAP]
C40  0.22uF  CAPACITOR0402_CAP  [0402_CAP]
C41  0.22uF  CAPACITOR0402_CAP  [0402_CAP]
C67  4.7uF  CAPACITOR0402_CAP  [0402_CAP]
C68  4.7uF  CAPACITOR0402_CAP  [0402_CAP]
C72  10uF  CAPACITOR0603_CAP  [0603_CAP]
C73  10uF  CAPACITOR0603_CAP  [0603_CAP]
FB1  BLM03PG330SN1D  FERRITE_BEAD0201  [0201_FB]
R1  49.9-1%  RESISTOR0201_RES  [0201_RES]
R29  100k  RESISTOR0402_RES  [0402_RES]
S2  SKY13373  [SKY13373]
S3  SIP3241XSIP32414  [TDFN2X2X0P6-8]
TP0  TEST-POINT  [PAD.03X.03]
TP1  TEST-POINT  [PAD.03X.03]
TP2  TEST-POINT  [PAD.03X.03]
TP3  TEST-POINT  [PAD.03X.03]
TP4  TEST-POINT  [PAD.03X.03]
TP5  TEST-POINT  [PAD.03X.03]
TP6  TEST-POINT  [PAD.03X.03]
TP7  TEST-POINT  [PAD.03X.03]
U2  DW3210  [QFN40P500X500X80-40N]
X4  38.4MHz  FA-20H  [FA-20H]

### Nets
!DW_RST: U2.33(!RST) ; also sheet 1
!DW_SPI_CS: U2.37(!SPICS) ; also sheet 1,5
+1V8: C41.1 C68.2 S3.4(IN) U2.29(VDD1) ; also sheet 1,2,3
+2V5: C34.1 C67.2 S2.6(VDD) S3.1(IN) ; also sheet 2,3
DW_EXTON: S3.2(CTL) S3.3(CTL) U2.31(EXTON)
DW_GPIO4: TP4.P$1(TESTPOINT) U2.8(GPIO4/EXTPA)
DW_GPIO5: TP5.P$1(TESTPOINT) U2.5(GPIO5/EXTTXE/SPIPOL)
DW_GPIO6: TP6.P$1(TESTPOINT) U2.2(GPIO6/EXTRXE/SPIPHA)
DW_IRQ: R29.2 U2.1(IRQ/GPIO8) ; also sheet 1
DW_RF1: C3.P$1 U2.18(RF1)
DW_RF2: R1.1 U2.13(RF2)
DW_RXLED: TP2.P$1(TESTPOINT) U2.6(GPIO2/RXLED)
DW_RXOKLED: TP0.P$1(TESTPOINT) U2.3(GPIO0/RXOKLED)
DW_SFDLED: TP1.P$1(TESTPOINT) U2.4(GPIO1/SFDLED)
DW_SPI_CIPO: U2.36(SPICDO(MISO)) ; also sheet 1,5
DW_SPI_CLK: U2.34(SPICLK) ; also sheet 1,5
DW_SPI_COPI: U2.35(SPICDI(MOSI)) ; also sheet 1,5
DW_SYNC: TP7.P$1(TESTPOINT) U2.9(GPIO7/SYNC)
DW_TXLED: TP3.P$1(TESTPOINT) U2.7(GPIO3/TXLED)
DW_VDD2_SUP: C17.1 C33.1 C37.1 C73.1 FB1.P$1 S3.8(OUT) U2.23(VDD2B)
DW_VDD2A: C16.1 FB1.P$2 U2.28(VDD2A)
DW_VDD3_SUP: C18.1 C36.1 C39.1 C72.1 S3.5(OUT) U2.26(VDD3)
DW_VIO_D: C38.1 U2.38(VIO_D)
DW_VTX_D: C40.1 U2.27(VTX_D)
DW_WAKEUP: U2.32(WAKEUP) ; also sheet 1
DW_XTI: C11.1 U2.21(XTI) X4.3
DW_XTO: C10.1 U2.22(XTO) X4.1
GND: C10.2 C11.2 C16.2 C17.2 C18.2 C33.2 C34.2 C36.2 C37.2 C38.2 C39.2 C40.2 C41.2 C67.1 C68.1 C72.2 C73.2 R1.2 R29.1 S2.2(GND) S2.7(GND) S2.8(GND) S2.10(GND) S2.12(GND) S2.PAD(GND) S3.6(GND) S3.7(GND) S3.PAD(GND) U2.10(GND-RF) U2.11(GND-RF) U2.12(GND-RF) U2.14(GND-RF) U2.15(GND-RF) U2.16(GND-RF) U2.17(GND-RF) U2.19(GND-RF) U2.20(GND-RF) U2.24(VSS2) U2.25(VSS3) U2.30(VSS1) U2.39(VSS) U2.40(VSS) X4.2(GND) X4.4(GND) ; also sheet 1,2,3
RF1: A1.FEED(ANTENNA) S2.9(J2)
RF2: A2.FEED(ANTENNA) S2.3(J3)
RF3: A3.FEED(ANTENNA) S2.1(J1)
RFC: C3.P$2 S2.11(RFC)
RFSW_V1: S2.4(V1) ; also sheet 1
RFSW_V2: S2.5(V2) ; also sheet 1

### Notes on the sheet
- UWB: DW3210 and Switches | Antennas
- SupV 2.5-4.8
  I/O V 1.65-min(3.3,SupV)
  Active: 60 µA
  Qui: 5 µA
- Supply 2.4 - 3.6 V
      ds #'s @ 3.0 V
  
          min typ max
  VDD1    1.6 3.0 3.6
  VDD2a,b 2.4 3.0 3.6
  VDD3    1.5 3.0 3.6
  
  Voltage on GPIO0-5,
  WAKEUP, RSTn, SPICSn,
  SPIMOSI, SPICLK
   -> Max: VDD1+0.3V
  
  I/O current (max): 10 mA
   VDD1 -> I/O
  
  Peak cont current
  is RX CH9: 88 mA
  
  TX worst-case:
   VDD2a/b: 20 mA
   VDD3: 20 mA
  
  RX worst-case:
   VDD2a/b: ~5 mA
   VDD3: ~70 mA
  
  Quiescent: 0.26 µA
- V1 V2 State
   0  0  Shutdown
   1  0  RFC<>J2
   0  1  RFC<>J1
   1  1  RFC<>J3
- Pull-down
  for (DEEP)SLEEP

## Sheet 5 of 5: External signals
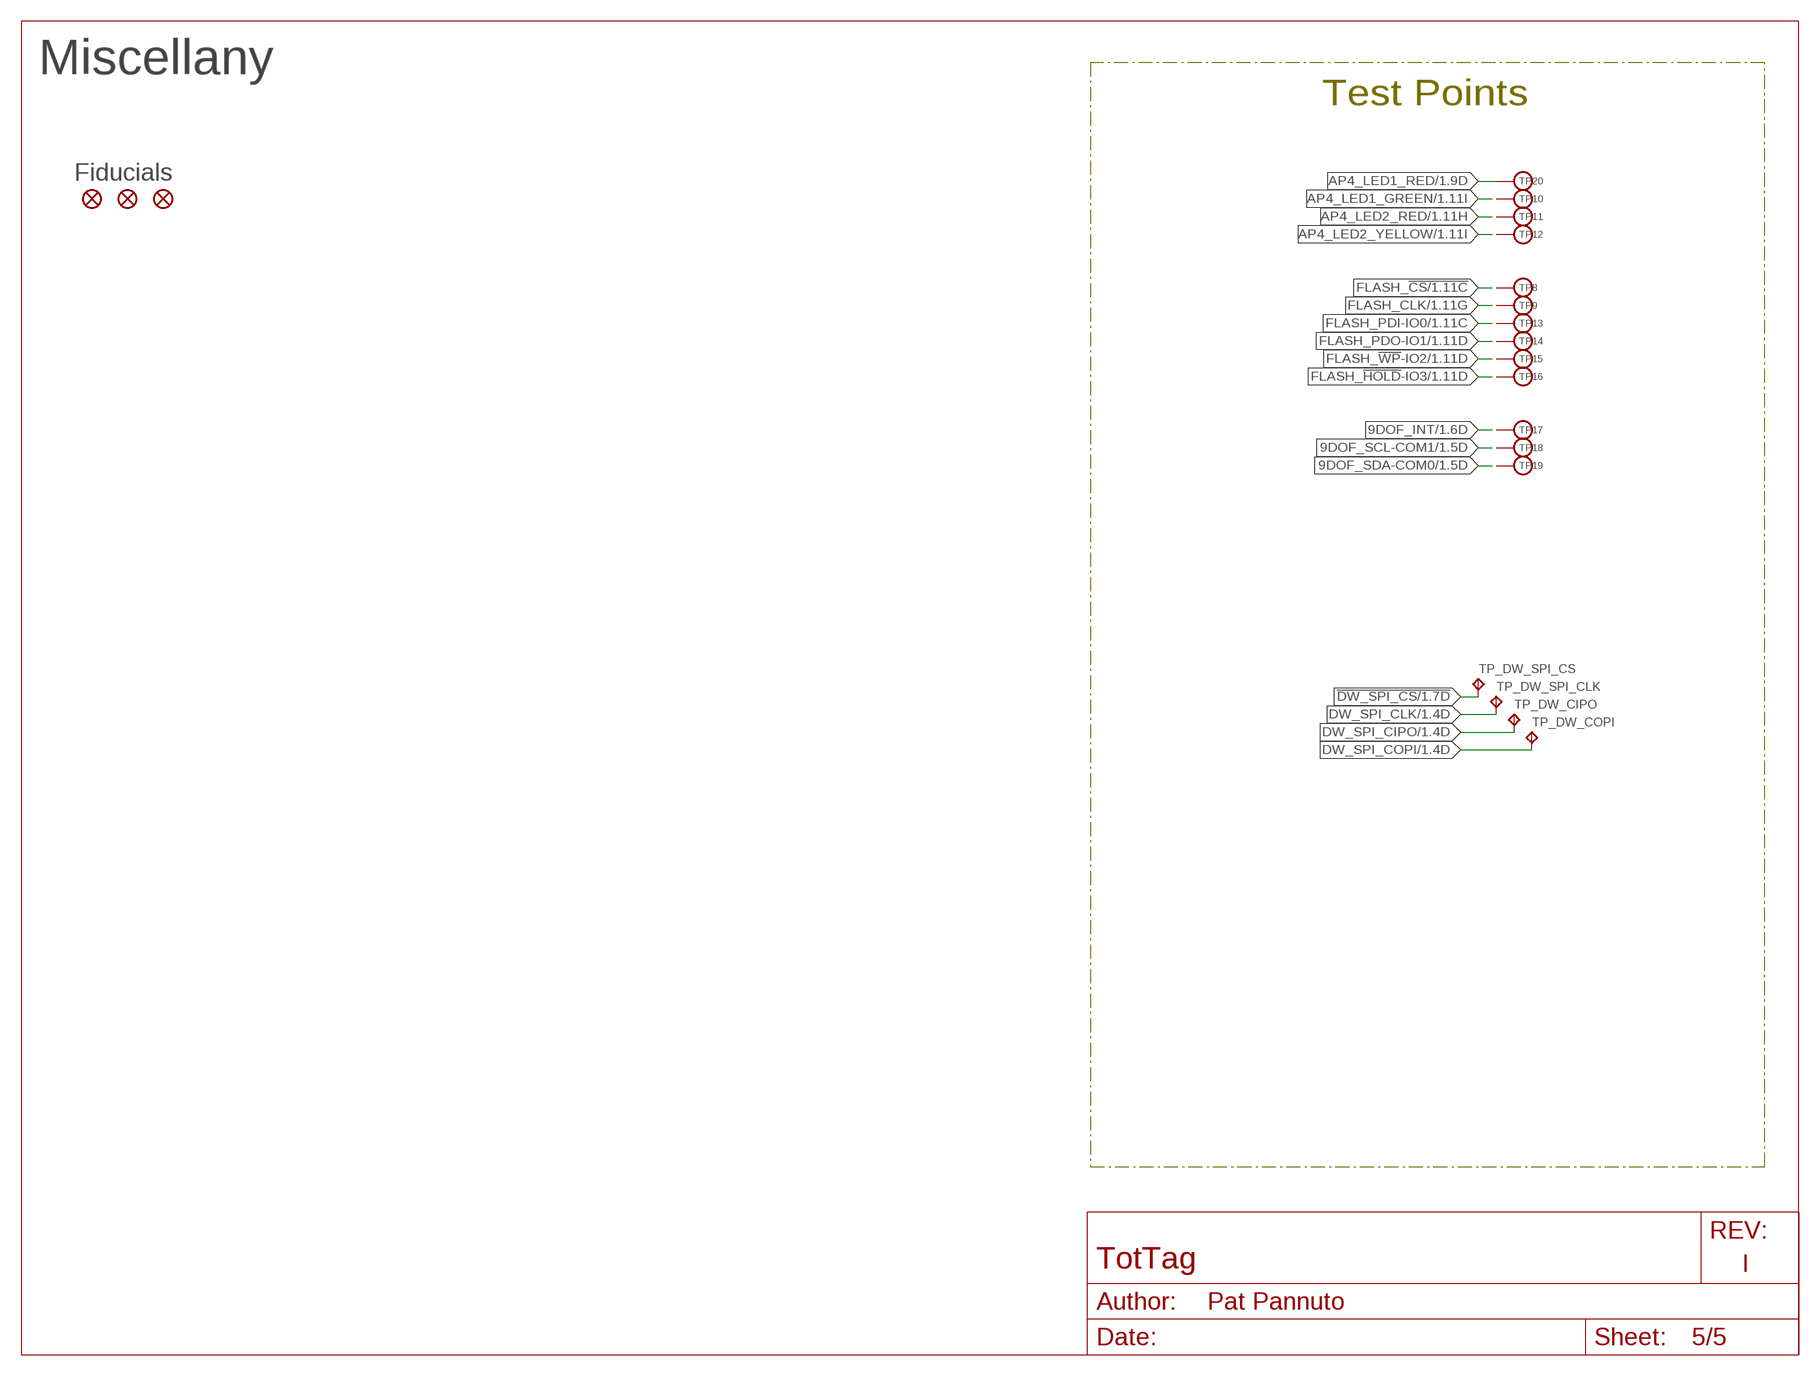
[diagram p4: schematic, sheet 5]

### Parts
FD1  FIDUCIAL1X2  [FIDUCIAL-1X2]
FD2  FIDUCIAL1X2  [FIDUCIAL-1X2]
FD3  FIDUCIAL1X2  [FIDUCIAL-1X2]
TP8  TEST-POINT  [PAD.03X.03]
TP9  TEST-POINT  [PAD.03X.03]
TP10  TEST-POINT  [PAD.03X.03]
TP11  TEST-POINT  [PAD.03X.03]
TP12  TEST-POINT  [PAD.03X.03]
TP13  TEST-POINT  [PAD.03X.03]
TP14  TEST-POINT  [PAD.03X.03]
TP15  TEST-POINT  [PAD.03X.03]
TP16  TEST-POINT  [PAD.03X.03]
TP17  TEST-POINT  [PAD.03X.03]
TP18  TEST-POINT  [PAD.03X.03]
TP19  TEST-POINT  [PAD.03X.03]
TP20  TEST-POINT  [PAD.03X.03]
TP_DW_CIPO  TPTP06SQ  [TP06SQ]
TP_DW_COPI  TPTP06SQ  [TP06SQ]
TP_DW_SPI_CLK  TPTP06SQ  [TP06SQ]
TP_DW_SPI_CS  TPTP06SQ  [TP06SQ]

### Nets
9DOF_INT: TP17.P$1(TESTPOINT) ; also sheet 1,3
9DOF_SCL-COM1: TP18.P$1(TESTPOINT) ; also sheet 1,3
9DOF_SDA-COM0: TP19.P$1(TESTPOINT) ; also sheet 1,3
!DW_SPI_CS: TP_DW_SPI_CS.TP ; also sheet 1,4
AP4_LED1_GREEN: TP10.P$1(TESTPOINT) ; also sheet 1
AP4_LED1_RED: TP20.P$1(TESTPOINT) ; also sheet 1
AP4_LED2_RED: TP11.P$1(TESTPOINT) ; also sheet 1
AP4_LED2_YELLOW: TP12.P$1(TESTPOINT) ; also sheet 1
DW_SPI_CIPO: TP_DW_CIPO.TP ; also sheet 1,4
DW_SPI_CLK: TP_DW_SPI_CLK.TP ; also sheet 1,4
DW_SPI_COPI: TP_DW_COPI.TP ; also sheet 1,4
FLASH_!CS: TP8.P$1(TESTPOINT) ; also sheet 1,3
FLASH_!HOLD!-IO3: TP16.P$1(TESTPOINT) ; also sheet 1,3
FLASH_!WP!-IO2: TP15.P$1(TESTPOINT) ; also sheet 1,3
FLASH_CLK: TP9.P$1(TESTPOINT) ; also sheet 1,3
FLASH_PDI-IO0: TP13.P$1(TESTPOINT) ; also sheet 1,3
FLASH_PDO-IO1: TP14.P$1(TESTPOINT) ; also sheet 1,3

### Notes on the sheet
- Miscellany
- Test Points
- Fiducials

## Library data of the parts
A1-A3 = antennas:ACR0301U; MANUFACTURER: Abracon; MPN: ACR0301U
A4 = antennas:AMCA72-2R47G-S1F-T: WiFi/Bluetooth/ZigBee, ISM Atenna Abracon Page <https://abracon.com/parametric/antennas/AMCA72-2R470G-S1F-T>; DESCRIPTION: RF ANT 2.4GHZ CHIP SOLDER SMD; DIGIKEY: 535-14108-1-ND; MPN: AMCA72-2R470G-S1F-T4
C1 = passives:CAPACITOR: SMD Capacitor; MPN: GJM1555C1HR50WB01D
C2 = passives:CAPACITOR: SMD Capacitor; MPN: GJM1555C1HR80WB01D
C3 = passives:CAPACITOR: SMD Capacitor; MPN: CBR02C209A5GAC
C4-C7 = passives:CAPACITOR: SMD Capacitor; MANUFACTURER: Murata; MPN: GRM0335C1H4R0BA01D
C8 C9 = passives:CAPACITOR: SMD Capacitor; MANUFACTURER: Murata; MPN: GRM0335C1H6R0BA01D
C10 C11 = passives:CAPACITOR: SMD Capacitor; DIGIKEY: 399-8815-2-ND; MPN: CBR04C120F5GAC
C12 C13 = passives:CAPACITOR: SMD Capacitor; MPN: GRM0335C1H220FA01D
C14 C15 = passives:CAPACITOR: SMD Capacitor; DESCRIPTION: CAP CER 470PF 50V C0G/NP0 0402; DIGIKEY: 490-6242-1-ND; MANUFACTURER: Murata; MPN: GRM1555C1H471JA01J
C16-C18 = passives:CAPACITOR: SMD Capacitor; MPN: C0402C472K3RAC7867
C19 C20 = passives:CAPACITOR: SMD Capacitor; DIGIKEY: 490-6351-2-ND; MPN: GRM155R71H103KA88J
C21-C23 = passives:CAPACITOR: SMD Capacitor; DIGIKEY: 490-10699-2-ND; MPN: GRM155R71E223JA61D
C24 C25 = passives:CAPACITOR: SMD Capacitor; DIGIKEY: 311-3823-1-ND; MPN: CC0402ZRY5V8BB223
C26 C31-C39 = passives:CAPACITOR: SMD Capacitor; MPN: CL05A104KP5NNNC
C27-C30 = passives:CAPACITOR: SMD Capacitor; DIGIKEY: 490-6328-1-ND; MPN: GRM155R71C104KA88J
C40 C41 = passives:CAPACITOR: SMD Capacitor; MPN: CL05A224KP5NNNC
C42 C43 = passives:CAPACITOR: SMD Capacitor; DIGIKEY: 490-12270-1-ND; MPN: GRT155R61E474ME01D
C44-C48 C52 C53 C74 = passives:CAPACITOR: SMD Capacitor; MANUFACTURER: Murata; MPN: GRM033R61A105ME44D
C49-C51 = passives:CAPACITOR: SMD Capacitor; DIGIKEY: 490-7195-1-ND; MPN: GRM155R70G105KA12D
C54-C59 = passives:CAPACITOR: SMD Capacitor; MANUFACTURER: Murata; MPN: GRM033R61A225KE47D
C60 C67 C68 = passives:CAPACITOR: SMD Capacitor; MPN: CL05A475MP5NRNC
C61-C66 = passives:CAPACITOR: SMD Capacitor; MANUFACTURER: Taiyo Yuden; MPN: JMK212ABJ475MGHT
C69-C73 = passives:CAPACITOR: SMD Capacitor; DIGIKEY: 1253-CM105X5R106M25ATCT-ND; MPN: CM105X5R106M25AT
D1 = leds:BICOLOR-SMD; MPN: MCL0606FRD1GR1T
D2 = leds:BICOLOR-SMD; MPN: MCL0606FYW1RD1T
D3 = SparkFun-LED:LED: LED (Generic) Standard schematic elements and footprints for 5mm, 3mm, 1206, and 0603 sized LEDs. Generic LEDs with no color specified.; DIGIKEY: 160-1446-1-ND; MPN: LTST-C191KGKT
D4 = passives:DIODE; DIGIKEY: 641-2087-1-ND; MPN: CDSQR400B-HF
FB1 = passives:FERRITE_BEAD; MANUFACTURER: Murata; MPN: BLM03PG330SN1D
FD1-FD3 = SparkFun-Aesthetics:FIDUCIAL: Fiducial Alignment Points Point-of-reference for pick-and-place machines and other optical instruments.
J1 = connector:USB4110-GF-A: CONN USB 2.0 TYPE-C R/A SMT; DESCRIPTION: USB-C (USB TYPE-C) USB 2.0 Receptacle Connector 24 (16+8 Dummy) Position Surface Mount, Right Angle; Through Hole; DIGIKEY: 2073-USB4110-GF-A-1-ND; MF: GCT; MPN: USB4110-GF-A; PACKAGE: None
J2 J3 = connector:TC2030-JLINK
J4 = connector:MOLEX-PICO-SPOX-3: MOLEX 1.50mm Pitch, Pico-SPOX PCB Header, Single Row, Surface Mount. Default connector of Shenzhen LiPo + Thermistor suppliers ca. 2020.; DIGIKEY: WM7647CT-ND; MFN: 874380343
JP1 JP7 = SparkFun-Jumpers:JUMPER-SMT_2_NC_TRACE: Normally closed trace jumper This jumper has a trace between two pads so it's normally closed (NC). Use a razor knife to open the connection. For best results follow the IPC guidelines for cutting traces: Cutout at least 0.063 mm (0.005 in). Remove all loose material to clean up the cut area. Seal the cut with an approved epoxy. Reapply solder to reclose the connection.
JP2-JP5 JP8 = SparkFun-Jumpers:JUMPER-SMT_3_1-NC_TRACE: Normally closed trace jumper (1 of 2 connections) This jumper has a trace between two pads so it's normally closed (NC). The other connection is normally open (NO). Use a razor knife to open the connection. For best results follow the IPC guidelines for cutting traces: Cutout at least 0.063 mm (0.005 in). Remove all loose material to clean up the cut area. Seal the cut with an approved epoxy. Reapply solder to reclose the connection, or to close the NO connection.
JP6 = SparkFun-Jumpers:JUMPER-SMT_2_NO: Normally open jumper This jumper has two pads in close proximity to each other. Apply solder to close the connection. Round pads are easier to solder for beginners, but are a lot larger. SparkFun Product that uses the round pads: SparkFun EL Sequencer <https://www.sparkfun.com/products/12781>
JP9 = pinhead:PINHD-1X2: PIN HEADER
L1 = passives:INDUCTOR: A very specific inductor; MANUFACTURER: Murata; MPN: DFE201210U-2R2M=P2
L2 = passives:INDUCTOR: A very specific inductor; MANUFACTURER: Murata; MPN: DFE18SAN1R0ME0L
L3 = passives:INDUCTOR: A very specific inductor; MPN: LQW15AN4N7G8ZD
L4 = ac:WURTH_COIL_760308103204; DIGIKEY: 732-5258-ND; MANUFACTURER: Würth Elektronik; MPN: 760308103204
L5 L6 = passives:INDUCTOR: A very specific inductor; MANUFACTURER: TAIYO YUDEN; MPN: NR3015T100M
LS1 = audio:PUI_SMT-0440-T-2-R; DIGIKEY: 668-SMT-0440-T-2-RTR-ND; MPN: SMT-0440-T-2-R
Q1 = fets:CSD75207W15: low on resistance, gate charge dual p-channel nexfet; DIGIKEY: 296-40008-1-ND; MANUFACTURER: TEXAS INSTRUMENTS; MPN: CSD75207W15
Q2 = fets:MOSFET-NCHANNEL: Generic NMOS footprint; DIGIKEY: DMN2400UFB4-7DICT-ND
R1 = passives:RESISTOR: Resistor Basic schematic elements and footprints for 0201, 0402, 0603, 1206, and PTH resistors.; MPN: ERJ-1GNF49R9C
R2 R3 = passives:RESISTOR: Resistor Basic schematic elements and footprints for 0201, 0402, 0603, 1206, and PTH resistors.; DIGIKEY: RMCF0402FT97R6CT-ND; MPN: RMCF0402FT97R6
R4 R5 = passives:RESISTOR: Resistor Basic schematic elements and footprints for 0201, 0402, 0603, 1206, and PTH resistors.; DIGIKEY: RMCF0402FT162RCT-ND; MPN: RMCF0402FT162R
R6 R14 R15 R100-R103 = passives:RESISTOR: Resistor Basic schematic elements and footprints for 0201, 0402, 0603, 1206, and PTH resistors.
R7 R9 = passives:RESISTOR: Resistor Basic schematic elements and footprints for 0201, 0402, 0603, 1206, and PTH resistors.; MPN: ERJ-1GNF8453C
R8 = passives:RESISTOR: Resistor Basic schematic elements and footprints for 0201, 0402, 0603, 1206, and PTH resistors.; MPN: ERJ-1GNF4223C
R10 = passives:RESISTOR: Resistor Basic schematic elements and footprints for 0201, 0402, 0603, 1206, and PTH resistors.; MPN: ERJ-1GNF2613C
R11 R25 = passives:RESISTOR: Resistor Basic schematic elements and footprints for 0201, 0402, 0603, 1206, and PTH resistors.; MPN: RC0402JR-0715RL
R12 R26 = passives:RESISTOR: Resistor Basic schematic elements and footprints for 0201, 0402, 0603, 1206, and PTH resistors.; MPN: RC0402JR-075R1L
R16 R20-R24 = passives:RESISTOR: Resistor Basic schematic elements and footprints for 0201, 0402, 0603, 1206, and PTH resistors.; DIGIKEY: 311-10KJRCT-ND; MPN: RC0402JR-0710KL
R17 = passives:RESISTOR: Resistor Basic schematic elements and footprints for 0201, 0402, 0603, 1206, and PTH resistors.; DIGIKEY: RMCF0402JT2K20CT-ND; MPN: RMCF0402JT2K20
R18 R19 = passives:RESISTOR: Resistor Basic schematic elements and footprints for 0201, 0402, 0603, 1206, and PTH resistors.; DIGIKEY: RMCF0402FT5K10CT-ND; MPN: RMCF0402FT5K10
R28 R29 R32 = passives:RESISTOR: Resistor Basic schematic elements and footprints for 0201, 0402, 0603, 1206, and PTH resistors.; MPN: RT0402BRE07100KL
R30 = passives:RESISTOR: Resistor Basic schematic elements and footprints for 0201, 0402, 0603, 1206, and PTH resistors.; DIGIKEY: RMCF0402FT3M30CT-ND; MPN: RMCF0402FT3M30
R31 R33 R34 = passives:RESISTOR: Resistor Basic schematic elements and footprints for 0201, 0402, 0603, 1206, and PTH resistors.; DIGIKEY: RMCF0402FT5M10CT-ND; MPN: RMCF0402FT5M10
RT1 = passives:THERMISTOR: Thermistor. Temperature-controller resistor.; DIGIKEY: 490-18149-1-ND; MPN: NCU15XH103F60RC
S1 = Wurth_Switch_WS-SLSU:450404015514: WS-SLSU Mini Slide Switch, Same Side Connection Side Push 6.7x2.7 mm Properties Actuator Material:PA46 Actuator Flammability Rating:UL94 HB Actuator Color:Black Frame Material:LCP Frame Flammability Rating:UL94 V-0 Frame Color:Black Contact Material:Copper Alloy Contact Plating:Silver Terminal Material:Copper Alloy Terminal Plating:Silver Switching Function:On-On Schematic:SPDT Connection Type:Same Side Connection Qty.:3300 Material Properties Cover Material:Stainless Steel General Information Operating Temperature:-40 up to +85 °C Packaging Properties Packaging :Tape and Reel <https://www.we-online.com/catalog/media/o76706v209%20Family_WS-SLSU_Gruppe.jpg> Details see: https://www.we-online.com/catalog/en/SLSU_6_7X_2_7_SMD_HORIZONTAL/ Updated by yingchun,Shan;2020-02-25 2020(C) Würth Elektronik; DATASHEET-URL: https://www.we-online.com/catalog/datasheet/450404015514.pdf; DIGIKEY: 732-13665-1-ND; IR: 300mA; PACKAGING: Tape and Reel; PART-NUMBER: 450404015514; QTY: 150; VR: 5V(DC)
S2 = switches:SKY13373: 0.1 to 8.0 GHz SP3T Switch; MANUFACTURER: Skyworks; MPN: SKY13373-460LF
S3 = switches:SIP3241X; MANUFACTURER: Vishay; MPN: SIP32414DNP-T1-GE4
TP0 TP1-TP20 = headers:TEST-POINT
TP_DW_CIPO TP_DW_COPI TP_DW_SPI_CLK TP_DW_SPI_CS = testpad:TP: Test pad
U1 = Quorvo:APOLLO4_BLUE_SOC_BGA; MANUFACTURER: ambiq; MPN: AMA4B2KK-KBR
U2 = Quorvo:DW3210: DW3000 QFN No PDoA Ordering DW3210TR13; MANUFACTURER: Qorvo; MPN: DW3210
U3 = chips:BQ24040: Simple Li Ion / Li Poly charger.; DIGIKEY: 296-37142-1-ND; MPN: BQ24040DSQR
U4 = chips:BQ51013B: bq51013B Highly Integrated Wireless Receiver Qi (WPC v1.2) Compliant Power Supply; DIGIKEY: 296-38885-1-ND; MPN: BQ51013BRHLR
U5 = Quorvo:W25N01GWZEIG; MANUFACTURER: Winbond; MPN: W25N01GWZEIG
U6 = Quorvo:BNO055; MANUFACTURER: Bosch Scientific; MPN: BNO055
VR1 = regulators:RT8020; MANUFACTURER: RichTek; MPN: RT8020GQW
VR2 = regulators:TPS7A02; MPN: TPS7A0218PDQNR
X1 X2 = crystals:TXC-9HT12; C-LOAD: 7pF; FREQUENCY: 32.768 kHz; MANUFACTURER: TXC Corp; MPN: 9HT12-32.768KDZY-T
X3 = crystals:ABM12W; C-LOAD: 6pF; FREQUENCY: 32 MHz; MANUFACTURER: Abracon; MAX-ESR: 80Ω; MPN: ABM12W-32.0000MHZ-6-D1X-T3
X4 = crystals:FA-20H: Description: Oscillator by EPSON from 12MHz to 54 MHz; DATASHEET: https://support.epson.biz/td/api/doc_check.php?dl=brief_FA-20H_en.pdf; DESCRIPTION: 38.4MHz ±10ppm Crystal 8.5pF 40 Ohms 4-SMD, No Lead; DIGIKEY: SER3631CT-ND; MANUFACTURER: EPSON; MPN: FA-20H 38.4000MF10Z-AS3